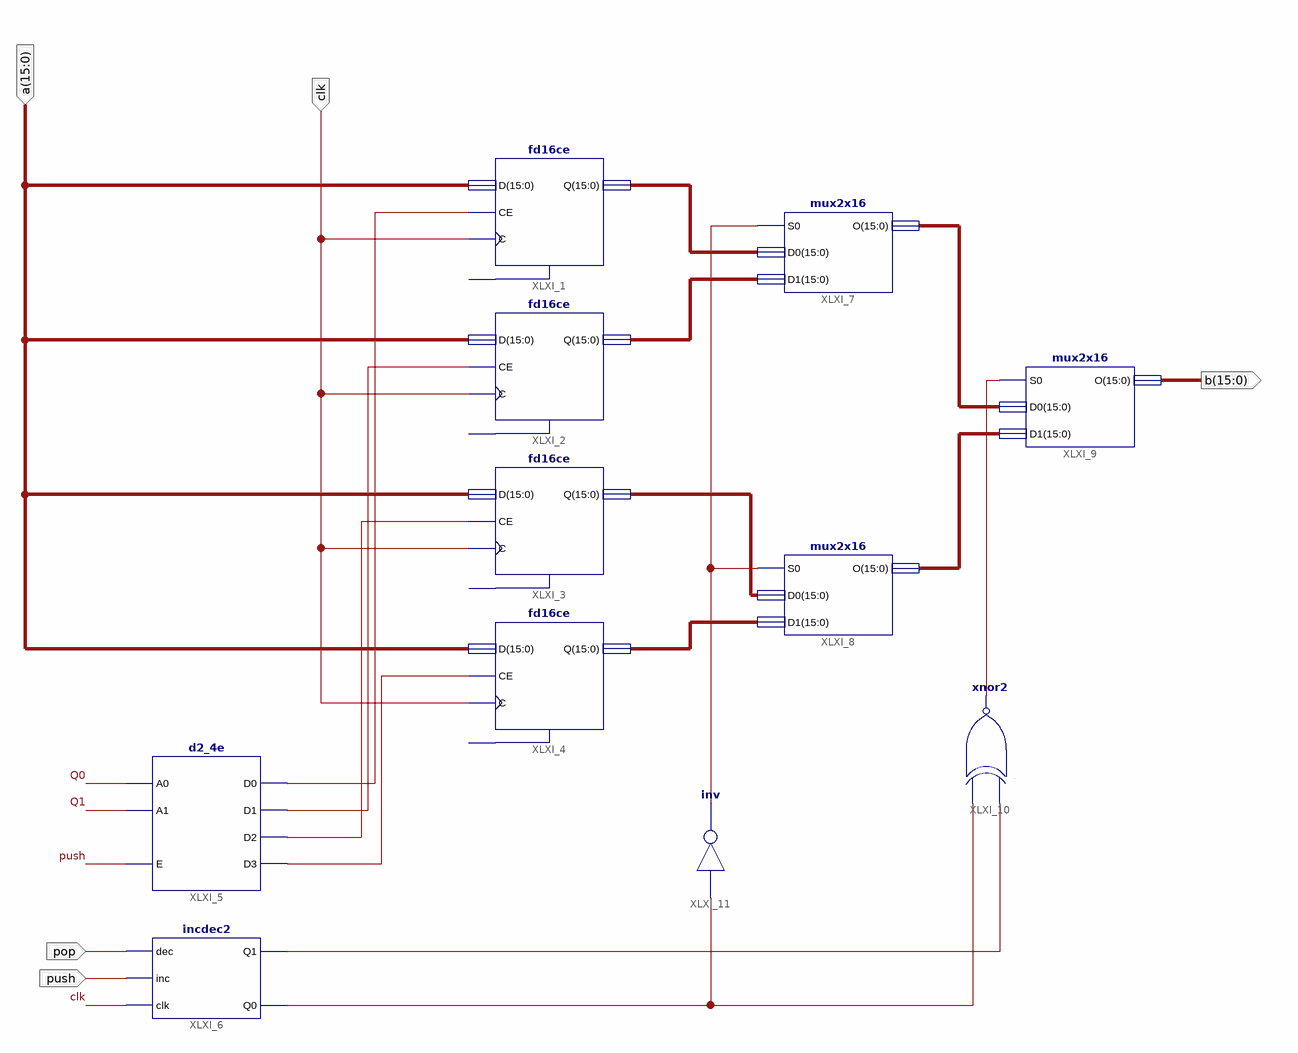
[diagram p0: schematic sheet 1]
// Xilinx ISE schematic PILE.sch (spartan3e) as structural Verilog: 11 symbols, 5 ports
module PILE (
  input  [15:0] a,
  input  clk,
  input  pop,
  input  push,
  output [15:0] b
);

  wire Q0, Q1, XLXN_4, XLXN_11, XLXN_14, XLXN_15, XLXN_16, XLXN_17;
  wire [15:0] XLXN_5, XLXN_6, XLXN_7, XLXN_8, XLXN_9, XLXN_10;

  fd16ce XLXI_1 (.C(clk), .CE(XLXN_14), .D(a), .Q(XLXN_7));  // open: CLR
  fd16ce XLXI_2 (.C(clk), .CE(XLXN_15), .D(a), .Q(XLXN_8));  // open: CLR
  fd16ce XLXI_3 (.C(clk), .CE(XLXN_16), .D(a), .Q(XLXN_5));  // open: CLR
  fd16ce XLXI_4 (.C(clk), .CE(XLXN_17), .D(a), .Q(XLXN_6));  // open: CLR
  d2_4e XLXI_5 (.A0(Q0), .A1(Q1), .E(push), .D0(XLXN_14), .D1(XLXN_15), .D2(XLXN_16), .D3(XLXN_17));
  incdec2 XLXI_6 (.dec(pop), .inc(push), .clk(clk), .Q1(Q1), .Q0(Q0));
  mux2x16 XLXI_7 (.S0(XLXN_4), .D0(XLXN_7), .D1(XLXN_8), .O(XLXN_9));
  mux2x16 XLXI_8 (.S0(XLXN_4), .D0(XLXN_5), .D1(XLXN_6), .O(XLXN_10));
  mux2x16 XLXI_9 (.S0(XLXN_11), .D0(XLXN_9), .D1(XLXN_10), .O(b));
  xnor XLXI_10 (XLXN_11, Q1, Q0);
  not XLXI_11 (XLXN_4, Q0);
endmodule
